# EAGLE schematic field_monitor (EAGLE 6.5.0)
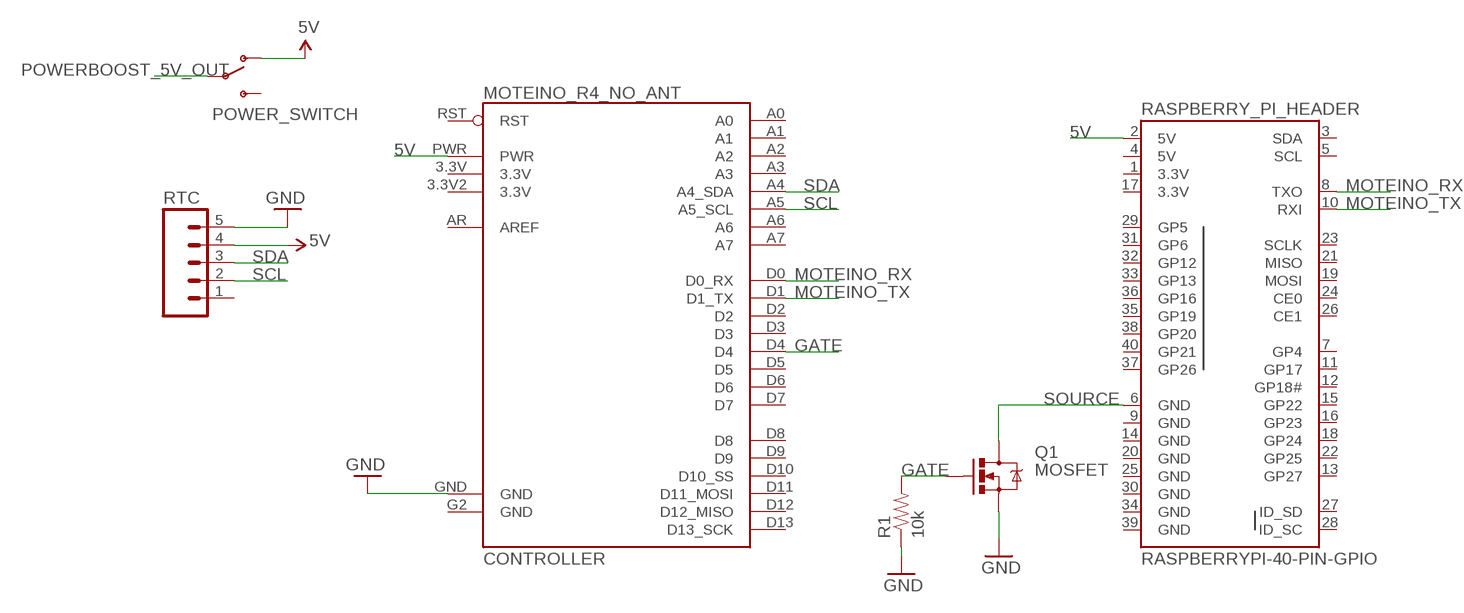
[diagram p0: schematic, sheet 1]

## Parts
CONTROLLER  MOTEINO_R4_NO_ANT  [MOTEINO_R4_NO_ANT]
POWER_SWITCH  SWITCH-SPDTPTH  [SWITCH-SPDT]
Q1  MOSFET  MOSFET-NCHANNELFQP30N06L  [TO220V]
R1  10k  RESISTORPTH-1/4W  [AXIAL-0.4]
RASPBERRY_PI_HEADER  RASPBERRYPI-40-PIN-GPIO  [2X20-SHROUDED]
RTC  M05PTH  [1X05]

## Nets
5V: CONTROLLER.PWR POWER_SWITCH.1(O) RASPBERRY_PI_HEADER.2(5V) RTC.4
GATE: CONTROLLER.D4 Q1.1(G) R1.P$2
GND: CONTROLLER.GND Q1.3(S) R1.P$1 RTC.5
MOTEINO_RX: CONTROLLER.D0(D0_RX) RASPBERRY_PI_HEADER.8(TXO)
MOTEINO_TX: CONTROLLER.D1(D1_TX) RASPBERRY_PI_HEADER.10(RXI)
POWERBOOST_5V_OUT: POWER_SWITCH.2(P)
SCL: CONTROLLER.A5(A5_SCL) RTC.2
SDA: CONTROLLER.A4(A4_SDA) RTC.3
SOURCE: Q1.2(D) RASPBERRY_PI_HEADER.6(GND)
Unconnected: CONTROLLER.3.3V CONTROLLER.3.3V2(3.3V) CONTROLLER.A0 CONTROLLER.A1 CONTROLLER.A2 CONTROLLER.A3 CONTROLLER.A6 CONTROLLER.A7 CONTROLLER.AR(AREF) CONTROLLER.D2 CONTROLLER.D3 CONTROLLER.D5 CONTROLLER.D6 CONTROLLER.D7 CONTROLLER.D8 CONTROLLER.D9 CONTROLLER.D10(D10_SS) CONTROLLER.D11(D11_MOSI) CONTROLLER.D12(D12_MISO) CONTROLLER.D13(D13_SCK) CONTROLLER.RST POWER_SWITCH.3(S) RASPBERRY_PI_HEADER.3(SDA) RASPBERRY_PI_HEADER.5(SCL) RASPBERRY_PI_HEADER.7(GP4) RASPBERRY_PI_HEADER.11(GP17) RASPBERRY_PI_HEADER.12(GP18#) RASPBERRY_PI_HEADER.13(GP27) RASPBERRY_PI_HEADER.15(GP22) RASPBERRY_PI_HEADER.16(GP23) RASPBERRY_PI_HEADER.18(GP24) RASPBERRY_PI_HEADER.19(MOSI) RASPBERRY_PI_HEADER.21(MISO) RASPBERRY_PI_HEADER.22(GP25) RASPBERRY_PI_HEADER.23(SCLK) RASPBERRY_PI_HEADER.24(CE0) RASPBERRY_PI_HEADER.26(CE1) RASPBERRY_PI_HEADER.27(ID_SD) RASPBERRY_PI_HEADER.28(ID_SC) RASPBERRY_PI_HEADER.29(GP5) RASPBERRY_PI_HEADER.31(GP6) RASPBERRY_PI_HEADER.32(GP12) RASPBERRY_PI_HEADER.33(GP13) RASPBERRY_PI_HEADER.35(GP19) RASPBERRY_PI_HEADER.36(GP16) RASPBERRY_PI_HEADER.37(GP26) RASPBERRY_PI_HEADER.38(GP20) RASPBERRY_PI_HEADER.40(GP21) RTC.1

## Power pins joined to a net without a drawn wire
3.3V: RASPBERRY_PI_HEADER.1(3.3V) RASPBERRY_PI_HEADER.17(3.3V)
5V: RASPBERRY_PI_HEADER.4(5V)
GND: CONTROLLER.G2(GND) RASPBERRY_PI_HEADER.9(GND) RASPBERRY_PI_HEADER.14(GND) RASPBERRY_PI_HEADER.20(GND) RASPBERRY_PI_HEADER.25(GND) RASPBERRY_PI_HEADER.30(GND) RASPBERRY_PI_HEADER.34(GND) RASPBERRY_PI_HEADER.39(GND)

## Library data of the parts
CONTROLLER = MoteinoR4Mod:MOTEINO_R4_NO_ANT
POWER_SWITCH = SparkFun-Electromechanical:SWITCH-SPDT: SPDT Switch Simple slide switch, Spark Fun Electronics SKU : COM-00102 DPDT SMT slide switch, AYZ0202, SWCH-08179; PROD_ID: SWCH-08261
Q1 = SparkFun-DiscreteSemi:MOSFET-NCHANNEL: Common NMOSFET Parts MFG P/N Store ID Prod ID FDD8780 TRANS-09984 SI7820DN TRANS-11055 FDS6630A IC-08089 2N7002PW TRANS-11151 FQP30N06L COM-10213 TRANS-10060 BSS123LT1G TRANS-08345 BSS138 TRANS-00830 BS170 2N7000; PROD_ID: TRANS-10060
R1 = SparkFun-Passives:RESISTOR: Resistor Basic schematic elements and footprints for 0603, 1206, and PTH resistors.
RASPBERRY_PI_HEADER = SparkFun-Boards:RASPBERRYPI-40-PIN-GPIO: Second Generation Raspberry Pi GPIO Header 2x20 pin connector, as found on B, B+, A+ models.
RTC = SparkFun-Connectors:M05: Header 5 Standard 5-pin 0.1" header. Use with straight break away headers (SKU : PRT-00116), right angle break away headers (PRT-00553), swiss pins (PRT-00743), machine pins (PRT-00117), and female headers (PRT-00115). Molex polarized connector foot print use with SKU : PRT-08230 with associated crimp pins and housings.